# Altium project ArduinoNano_IoT_shield_MRF24J40MA.PrjPcb
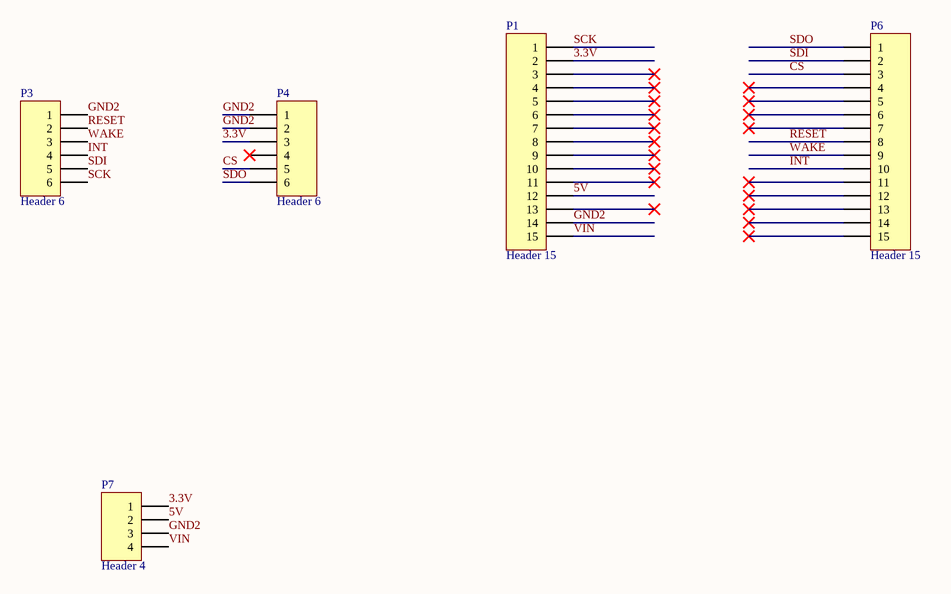
[diagram p0: MRF24J40MA_SHIELD.SchDoc]
2 sheets, 8 parts. Net scope: global (net labels, ports and power ports of the same name join across sheets).
Board files: shield_MRF24J40MA.PcbDoc, MRF24J40MA.PcbDoc
Sheets:
  MRF24J40MA_SHIELD.SchDoc
  MRF24J40MA.SchDoc

## Sheet MRF24J40MA_SHIELD.SchDoc
size A

### Parts
P1  Header 15  [HDR1X15]
P3  Header 6  [HDR1X6]
P4  Header 6  [HDR1X6]
P6  Header 15  [HDR1X15]
P7  Header 4  [HDR1X4]

### Nets
3.3V: P1.2 P4.3 P7.1
5V: P1.12 P7.2
CS: P4.5 P6.3
GND2: P1.14 P3.1 P4.1 P4.2 P7.3
INT: P3.4 P6.10
RESET: P3.2 P6.8
SCK: P1.1 P3.6
SDI: P3.5 P6.2
SDO: P4.6 P6.1
VIN: P1.15 P7.4
WAKE: P3.3 P6.9

Not connected (* = marked no-connect by the designer): P1 3* 4* 5* 6* 7* 8* 9* 10* 11* 13*; P4 4*; P6 4* 5* 6* 7* 11* 12* 13* 14* 15*

### Library data of the parts
P1 P6 = Header 15: Header, 15-Pin; LatestRevisionDate: 17-Jul-2002; LatestRevisionNote: Re-released for DXP Platform.; Publisher: Altium Limited
P3 P4 = Header 6: Header, 6-Pin; LatestRevisionDate: 17-Jul-2002; LatestRevisionNote: Re-released for DXP Platform.; Publisher: Altium Limited
P7 = Header 4: Header, 4-Pin; LatestRevisionDate: 17-Jul-2002; LatestRevisionNote: Re-released for DXP Platform.; Publisher: Altium Limited

## Sheet MRF24J40MA.SchDoc
size A
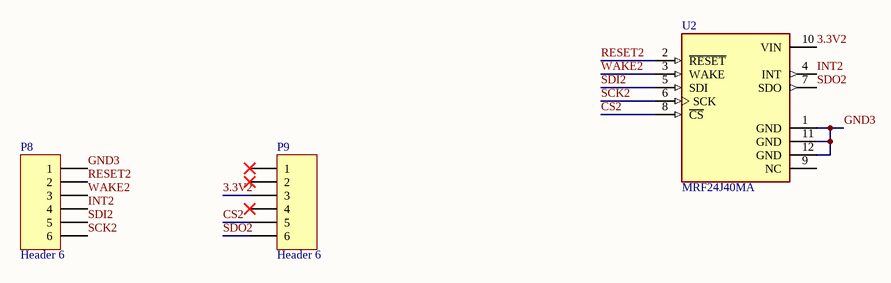
[diagram p1: MRF24J40MA.SchDoc]

### Parts
P8  Header 6  [HDR1X6]
P9  Header 6  [HDR1X6]
U2  MRF24J40MA  [MODULE_MRF24J40MA]

### Nets
3.3V2: P9.3 U2.10(VIN)
CS2: P9.5 U2.8(~{CS})
GND3: P8.1 U2.1(GND) U2.11(GND) U2.12(GND)
INT2: P8.4 U2.4(INT)
RESET2: P8.2 U2.2(~{RESET})
SCK2: P8.6 U2.6(SCK)
SDI2: P8.5 U2.5(SDI)
SDO2: P9.6 U2.7(SDO)
WAKE2: P8.3 U2.3(WAKE)

Not connected (* = marked no-connect by the designer): P9 1* 2* 4*; U2 9(NC)

### Library data of the parts
P8 P9 = Header 6: Header, 6-Pin; LatestRevisionDate: 17-Jul-2002; LatestRevisionNote: Re-released for DXP Platform.; Publisher: Altium Limited
U2 = MRF24J40MA: 802.15.4 Zigbee Transceiver Module 2.4GHz Integrated, Trace Surface Mount; MF: {'manufacturer': u'Microchip'}; MP: MRF24J40MA; Availability: Unavailable; Value: *; Package: None; Price: None